# EasyEDA schematic Amogus.json
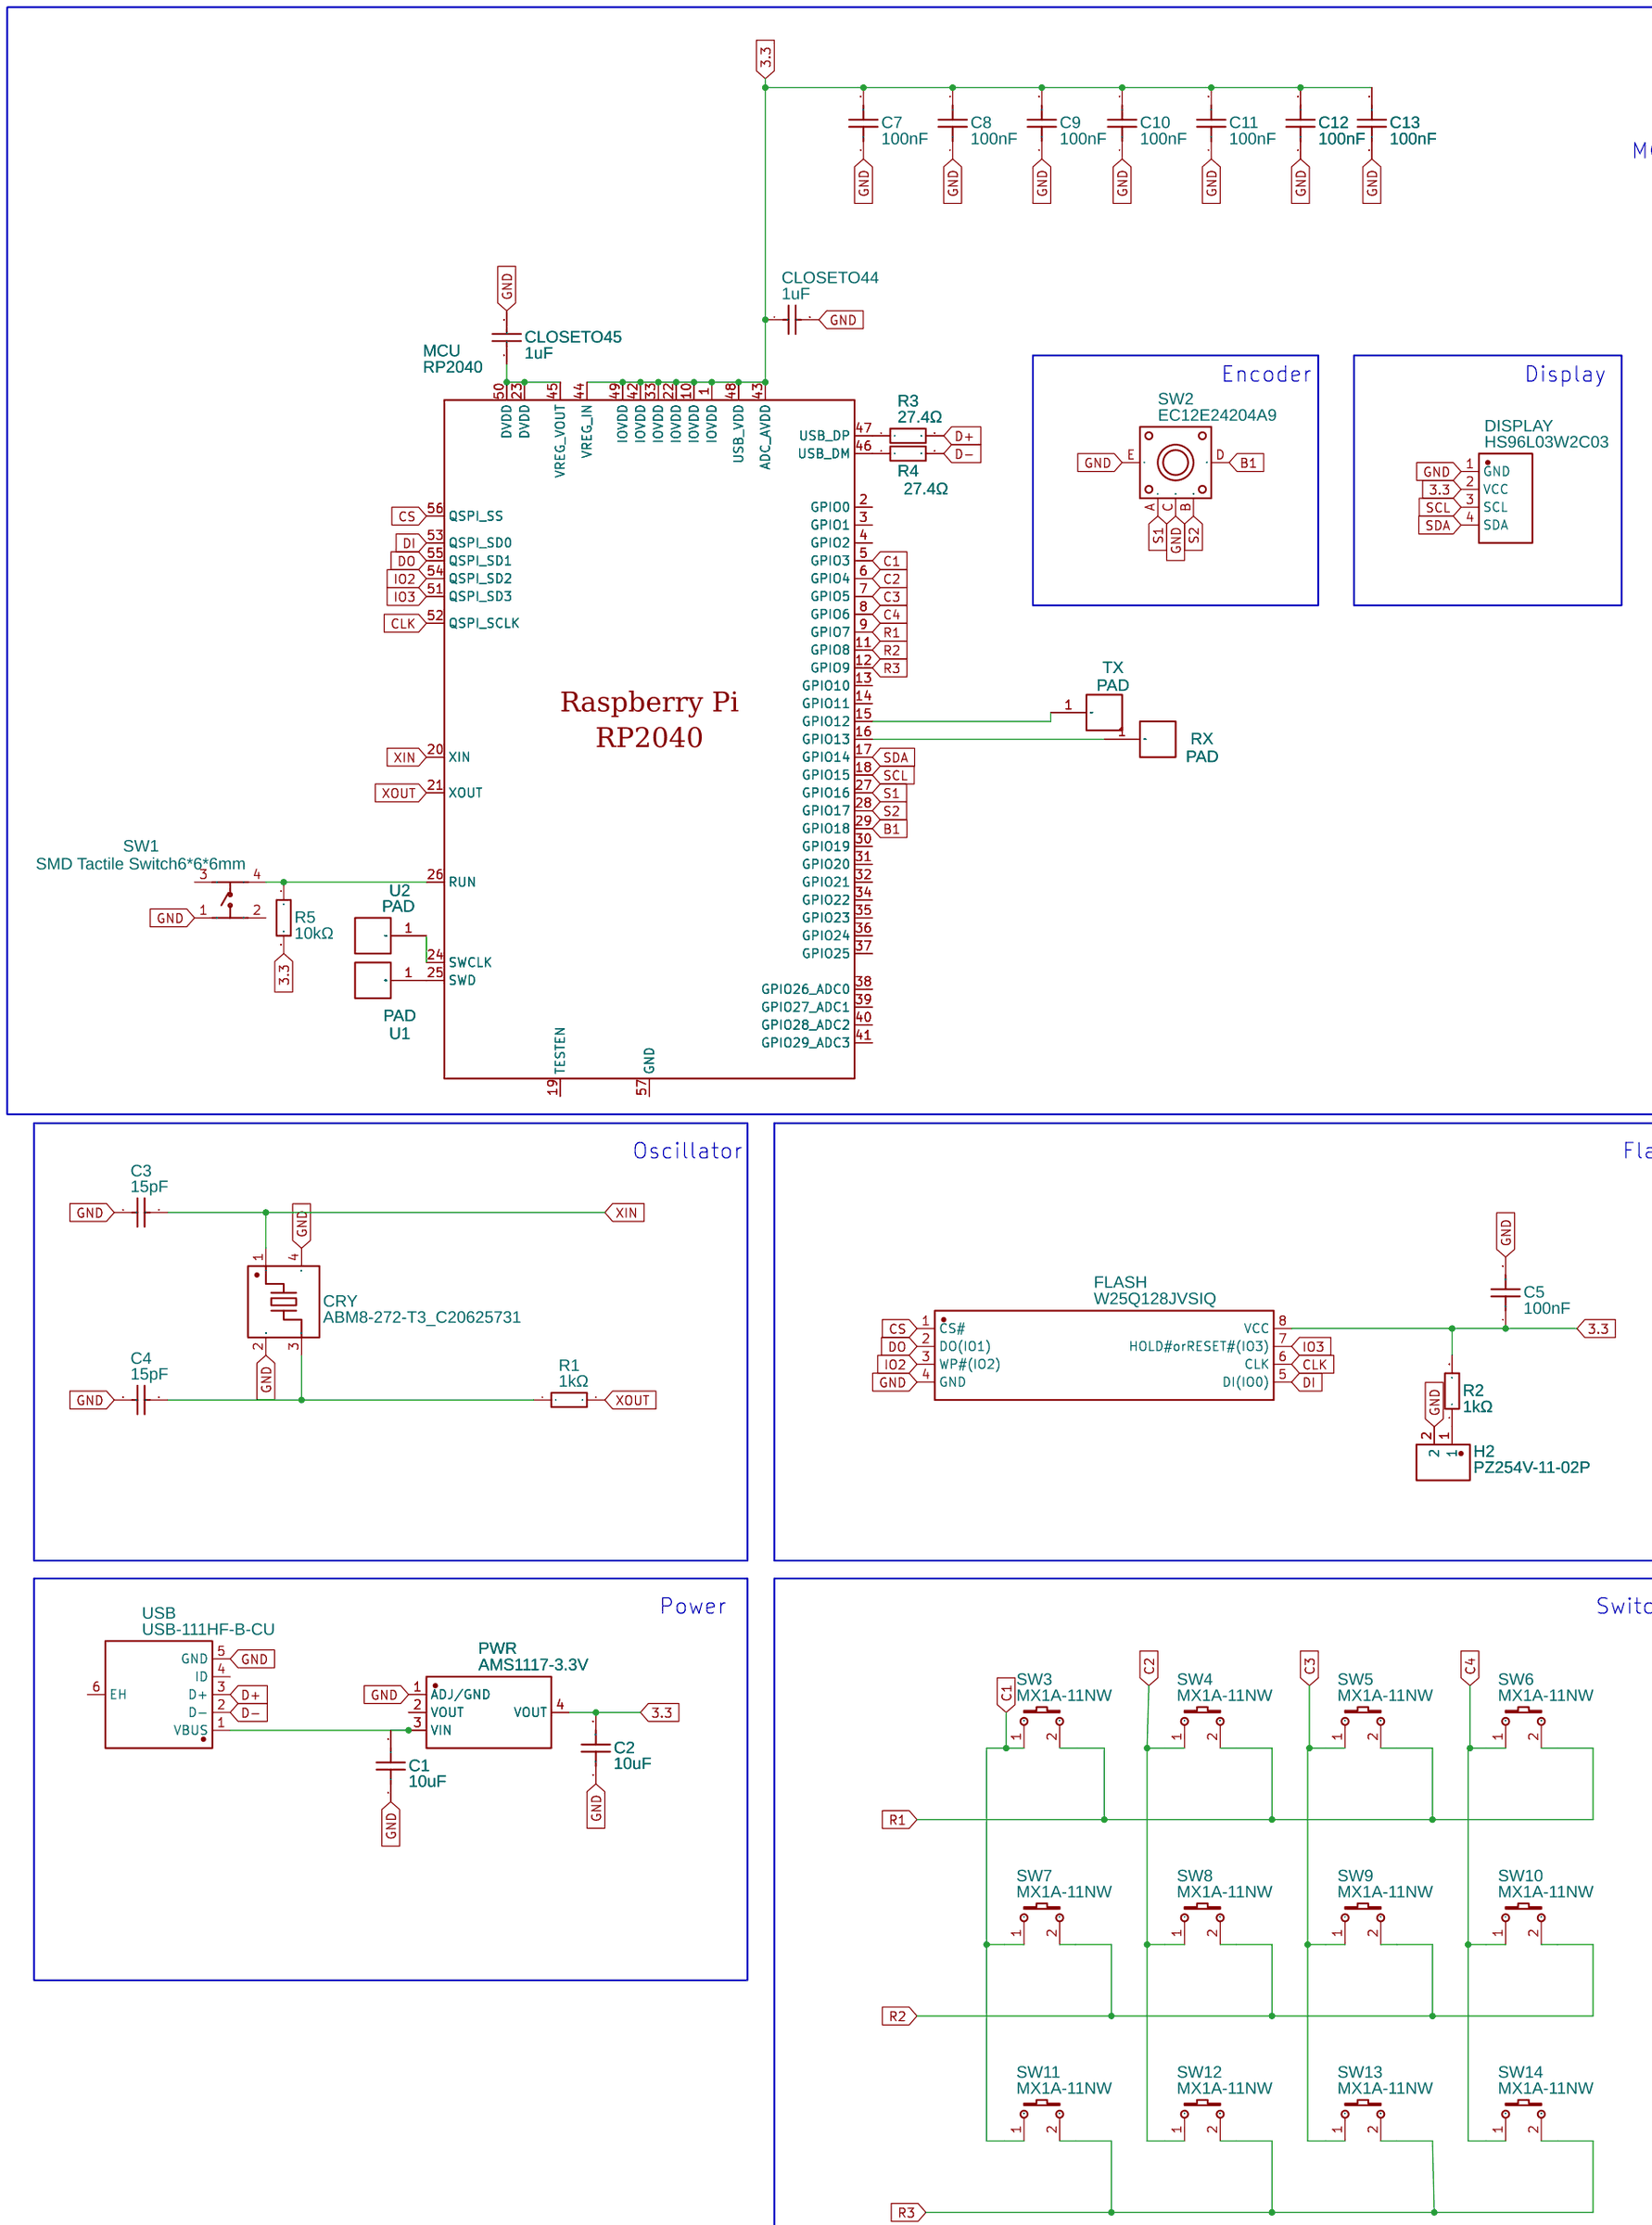
[diagram p0: schematic sheet]

## Parts
C1  10uF  [C0805]
C2  10uF  [C0805]
C3  15pF  [C0805]
C4  15pF  [C0805]
C5  100nF  [C0603]
C7  100nF  [C0603]
C8  100nF  [C0603]
C9  100nF  [C0603]
C10  100nF  [C0603]
C11  100nF  [C0603]
C12  100nF  [C0603]
C13  100nF  [C0603]
CLOSETO44  1uF  [C0402]
CLOSETO45  1uF  [C0402]
CRY  ABM8-272-T3_C20625731  [CRYSTAL-SMD_4P-L3.2-W2.5-BL]
DISPLAY  HS96L03W2C03  [OLED-TH_L27.8-W27.2-P2.54_C9900033791]
FLASH  W25Q128JVSIQ  [SOIC-8_L5.3-W5.3-P1.27-LS8.0-BL]
H2  PZ254V-11-02P  [HDR-TH_2P-P2.54-V-M]
MCU  RP2040  [LQFN-56_L7.0-W7.0-P0.4-EP]
PWR  AMS1117-3.3V  [SOT-223-4_L6.5-W3.5-P2.30-LS7.0-BR]
R1  1kΩ  [R0805]
R2  1kΩ  [R0805]
R3  27.4Ω  [R0603]
R4  27.4Ω  [R0603]
R5  10kΩ  [R0805]
RX  PAD  [PADPAD]
SW1  SMD Tactile Switch6*6*6mm  [SW-SMD_4P-L6.0-W6.0-P4.50-LS9.0_C23873]
SW2  EC12E24204A9  [SW-TH_EC12EXXXX]
SW3  MX1A-11NW  [SW-TH_MX1A-11NW]
SW4  MX1A-11NW  [SW-TH_MX1A-11NW]
SW5  MX1A-11NW  [SW-TH_MX1A-11NW]
SW6  MX1A-11NW  [SW-TH_MX1A-11NW]
SW7  MX1A-11NW  [SW-TH_MX1A-11NW]
SW8  MX1A-11NW  [SW-TH_MX1A-11NW]
SW9  MX1A-11NW  [SW-TH_MX1A-11NW]
SW10  MX1A-11NW  [SW-TH_MX1A-11NW]
SW11  MX1A-11NW  [SW-TH_MX1A-11NW]
SW12  MX1A-11NW  [SW-TH_MX1A-11NW]
SW13  MX1A-11NW  [SW-TH_MX1A-11NW]
SW14  MX1A-11NW  [SW-TH_MX1A-11NW]
TX  PAD  [PADPAD]
U1  PAD  [PADPAD]
U2  PAD  [PADPAD]
USB  USB-111HF-B-CU  [MICRO-USB-SMD_HOOYA_USB-111HF-B-CU]

## Library data of the parts
C1 C2 = CL21A106KAYNNNE: Supplier: LCSC; Manufacturer: SAMSUNG(三星); Supplier Part: C15850; JLCPCB Part Class: Basic Part
C3 C4 = 0805CG150J500NT: Supplier: LCSC; Manufacturer: FH(风华); Supplier Part: C63339; JLCPCB Part Class: Extended Part
C5 C7-C13 = CC0603KRX7R9BB104: Supplier: LCSC; Manufacturer: YAGEO(国巨); Supplier Part: C14663; JLCPCB Part Class: Basic Part
CLOSETO44 CLOSETO45 = GRM155R61E105KA12D: Supplier: LCSC; Manufacturer: muRata(村田); Supplier Part: C77009; JLCPCB Part Class: Extended Part
CRY = ABM8-272-T3_C20625731: Supplier: LCSC; Supplier Part: C20625731; Manufacturer: ABRACON; Manufacturer Part: ABM8-272-T3; JLCPCB Part Class: Extended Part; Contributor: lcsc
DISPLAY = HS96L03W2C03: Contributor: lcsc; Supplier: LCSC; Supplier Part: C5248080; Manufacturer: HS(汉昇); JLCPCB Part Class: Extended Part
FLASH = W25Q128JVSIQ: Contributor: LCSC; Supplier: LCSC; Supplier Part: C113767; Manufacturer: WINBOND(华邦); JLCPCB Part Class: Extended Part
H2 = PZ254V-11-02P: Contributor: LCSC; Supplier: LCSC; Supplier Part: C492401; Manufacturer: XFCN(兴飞); JLCPCB Part Class: Extended Part
MCU = RP2040: Contributor: LCSC; Supplier: LCSC; Supplier Part: C2040; Manufacturer: Raspberry Pi(树莓派); JLCPCB Part Class: Extended Part
PWR = AMS1117-3.3V: Contributor: LCSC; Supplier: LCSC; Supplier Part: C2688239; Manufacturer: WPMtek(维攀); JLCPCB Part Class: Extended Part
R1 R2 = 0805W8F1001T5E: Supplier: LCSC; Manufacturer: UNI-ROYAL(厚声); Supplier Part: C17513; JLCPCB Part Class: Basic Part
R3 R4 = RS-03K27R4FT: Contributor: LCSC; Supplier: LCSC; Supplier Part: C321831; Manufacturer: FH(风华); JLCPCB Part Class: Extended Part
R5 = 0805W8F1002T5E: Supplier: LCSC; Manufacturer: UNI-ROYAL(厚声); Supplier Part: C17414; JLCPCB Part Class: Basic Part
RX TX U1 U2 = PAD: Contributor: GURBUZ
SW1 = SMD Tactile Switch6*6*6mm: Supplier Part: C23873; Supplier: LCSC; Manufacturer: null; Manufacturer Part: 贴片轻触开关6*6*6mm; JLCPCB Part Class: Extended Part
SW2 = EC12E24204A9: Contributor: LCSC; Supplier: LCSC; Supplier Part: C470599; Manufacturer: ALPSALPINE(阿尔卑斯阿尔派); JLCPCB Part Class: Extended Part
SW3-SW14 = MX1A-11NW: Supplier: LCSC; Supplier Part: C3316924; Manufacturer: CHERRY; Contributor: lcsc
USB = USB-111HF-B-CU: Contributor: lcsc; Supplier: LCSC; Supplier Part: C2939561; Manufacturer: HOOYA(皓宇电子); JLCPCB Part Class: Extended Part

## Nets
GND: C1.1 C2.1 C3.2 C4.2 C5.2 C7.1 C8.1 C9.1 C10.1 C11.1 C12.1 C13.1 CLOSETO44.2 CLOSETO45.1 CRY.2(GND) CRY.4(GND) DISPLAY.1(GND) FLASH.4(GND) H2.2 PWR.1(ADJ/GND) SW1.1 SW2.C SW2.E USB.5(GND)
3.3: C2.2 C5.1 C7.2 C8.2 C9.2 C10.2 C11.2 C12.2 C13.2 CLOSETO44.1 DISPLAY.2(VCC) FLASH.8(VCC) MCU.1(IOVDD) MCU.10(IOVDD) MCU.22(IOVDD) MCU.33(IOVDD) MCU.42(IOVDD) MCU.43(ADC_AVDD) MCU.44(VREG_IN) MCU.48(USB_VDD) MCU.49(IOVDD) PWR.4(VOUT) R2.2 R5.2
B1: MCU.29(GPIO18) SW2.D
C1: MCU.5(GPIO3) SW3.1 SW7.1 SW11.1
C2: MCU.6(GPIO4) SW4.1 SW8.1 SW12.1
C3: MCU.7(GPIO5) SW5.1 SW9.1 SW13.1
C4: MCU.8(GPIO6) SW6.1 SW10.1 SW14.1
CLK: FLASH.6(CLK) MCU.52(QSPI_SCLK)
CS: FLASH.1(CS#) MCU.56(QSPI_SS)
D+: R3.2 USB.3(D+)
D-: R4.2 USB.2(D-)
DI: FLASH.5(DI(IO0)) MCU.53(QSPI_SD0)
DO: FLASH.2(DO(IO1)) MCU.55(QSPI_SD1)
IO2: FLASH.3(WP#(IO2)) MCU.54(QSPI_SD2)
IO3: FLASH.7(HOLD#orRESET#(IO3)) MCU.51(QSPI_SD3)
R1: MCU.9(GPIO7) SW3.2 SW4.2 SW5.2 SW6.2
R2: MCU.11(GPIO8) SW7.2 SW8.2 SW9.2 SW10.2
R3: MCU.12(GPIO9) SW11.2 SW12.2 SW13.2 SW14.2
S1: MCU.27(GPIO16) SW2.A
S2: MCU.28(GPIO17) SW2.B
SCL: DISPLAY.3(SCL) MCU.18(GPIO15)
SDA: DISPLAY.4(SDA) MCU.17(GPIO14)
XIN: C3.1 CRY.1 MCU.20(XIN)
XOUT: MCU.21(XOUT) R1.2
Net-(C1-2): C1.2 PWR.3(VIN) USB.1(VBUS)
Net-(C4-1): C4.1 CRY.3 R1.1
Net-(CLOSETO45-2): CLOSETO45.2 MCU.23(DVDD) MCU.45(VREG_VOUT) MCU.50(DVDD)
Net-(H2-1): H2.1 R2.1
Net-(MCU-15): MCU.15(GPIO12) TX.1(PADPAD123)
Net-(MCU-16): MCU.16(GPIO13) RX.1(PADPAD123)
Net-(MCU-24): MCU.24(SWCLK) U2.1(PADPAD123)
Net-(MCU-25): MCU.25(SWD) U1.1(PADPAD123)
Net-(MCU-26): MCU.26(RUN) R5.1 SW1.4
Net-(MCU-46): MCU.46(USB_DM) R4.1
Net-(MCU-47): MCU.47(USB_DP) R3.1

Not connected (* = marked no-connect by the designer): MCU 2(GPIO0) 3(GPIO1) 4(GPIO2) 13(GPIO10) 14(GPIO11) 19(TESTEN) 30(GPIO19) 31(GPIO20) 32(GPIO21) 34(GPIO22) 35(GPIO23) 36(GPIO24) 37(GPIO25) 38(GPIO26_ADC0) 39(GPIO27_ADC1) 40(GPIO28_ADC2) 41(GPIO29_ADC3) 57(GND); PWR 2(VOUT); SW1 2 3; USB 4(ID) 6(EH)

## Notes on the sheet
- MCU
- Encoder
- Display
- Oscillator
- Flash
- Power
- Switches
